# Altium schematic sheet Power.SchDoc
size A4; SheetNumber: 2; SheetTotal: 2
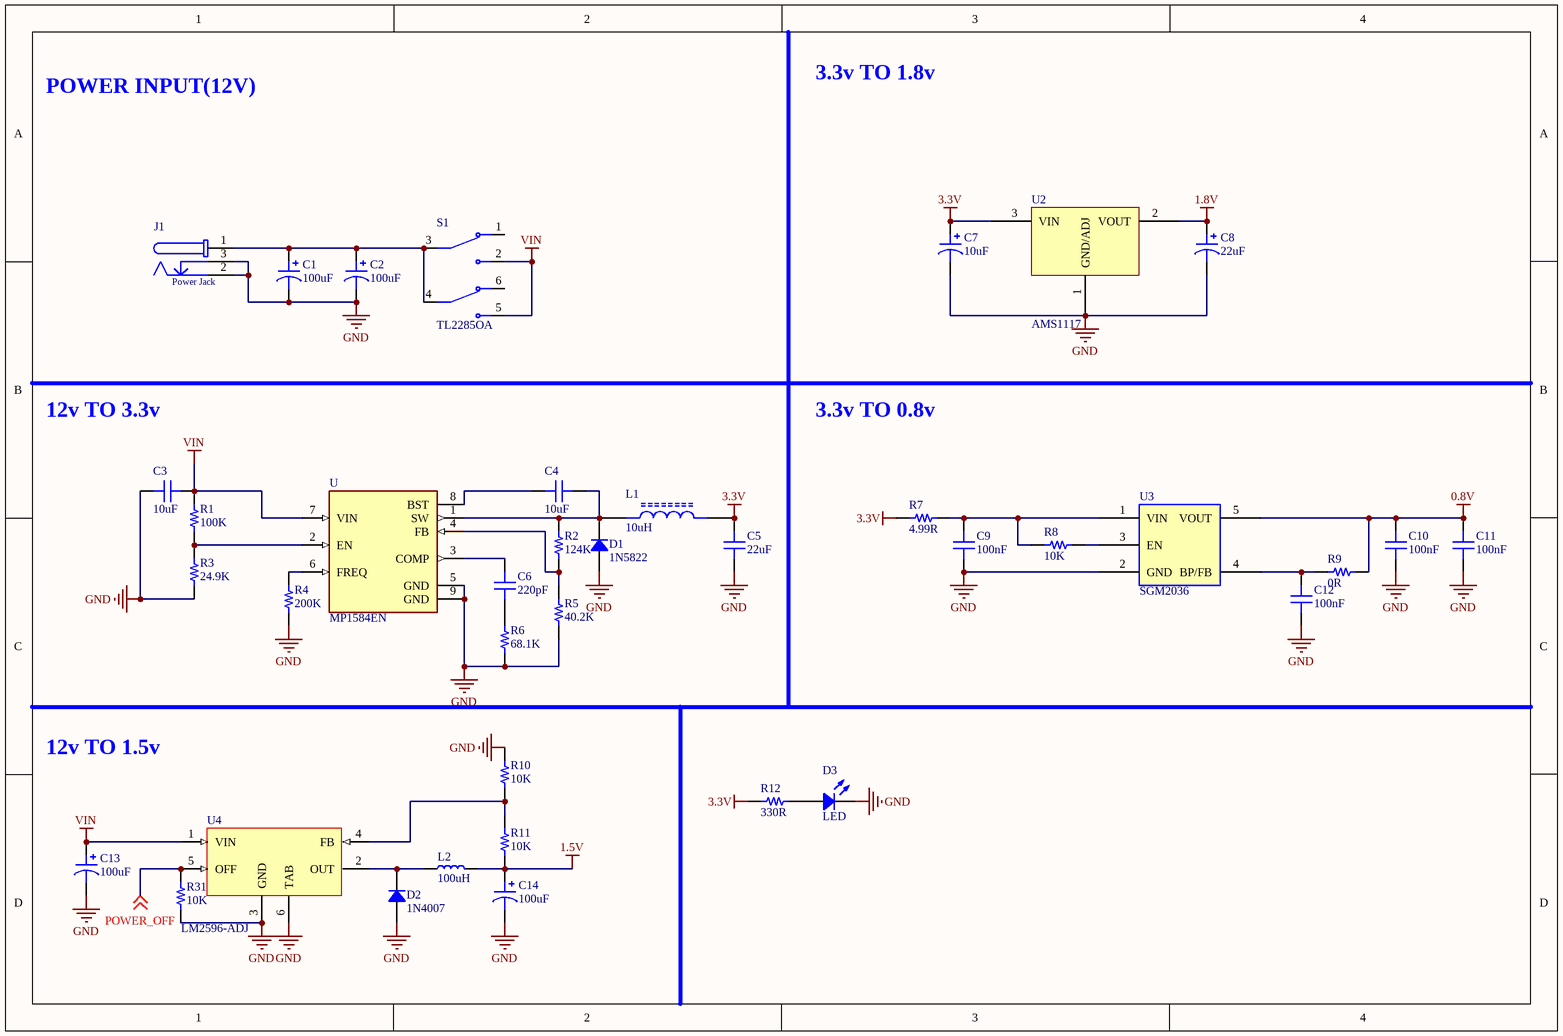
[diagram p0: Power.SchDoc]

## Parts
C1  100uF  [CAP ALUM 10.3MM]
C2  100uF  [CAP ALUM 10.3MM]
C3  10uF  [CAP-SMD-1206]
C4  10uF  [CAP-SMD-1206]
C5  22uF  [CAP-SMD-1206]
C6  220pF  [CAP-SMD-1206]
C7  10uF  [CAP-TAN-CASE-A]
C8  22uF  [CAP-TAN-CASE-A]
C9  100nF  [CAP-SMD-1206]
C10  100nF  [CAP-SMD-1206]
C11  100nF  [CAP-SMD-1206]
C12  100nF  [CAP-SMD-1206]
C13  100uF  [CAP-TAN-CASE-E]
C14  100uF  [CAP-TAN-CASE-E]
D1  1N5822  [m7]
D2  1N4007  [m7]
D3  LED  [LED_0805_RED]
J1  Power Jack  [DC-Jack-THT-RA-6.4]
L1  10uH  [SRN6045TA]
L2  100uH  [inductor]
R1  100K  [RES-SMD-0805]
R2  124K  [RES-SMD-0805]
R3  24.9K  [RES-SMD-0805]
R4  200K  [RES-SMD-0805]
R5  40.2K  [RES-SMD-0805]
R6  68.1K  [RES-SMD-0805]
R7  4.99R  [RES-SMD-0805]
R8  10K  [RES-SMD-0805]
R9  0R  [RES-SMD-0805]
R10  10K  [RES-SMD-0805]
R11  10K  [RES-SMD-0805]
R12  330R  [RES-SMD-0805]
R31  10K  [RES-SMD-0805]
S1  TL2285OA  [SW_TL2285OA]
U  MP1584EN  [SOIC127P600X170-9N]
U2  AMS1117  [AMS1117]
U3  SGM2036  [SOT23-5PIN]
U4  LM2596-ADJ  [LM2576]

## Nets
0.8V: C10.2 C11.2 R9.1 U3.5(VOUT)
1.5V: C14.1 L2.2 R11.2
1.8V: C8.1 U2.2(VOUT)
3.3V: C5.2 C7.1 L1.2 R7.2 R12.2 U2.3(VIN)
GND: C1.2 C2.2 C3.1 C5.1 C7.2 C8.2 C9.1 C10.1 C11.1 C12.1 C13.2 C14.2 D1.1 D2.1 D3.2 J1.2 J1.3 R3.1 R4.1 R5.1 R6.1 R10.1 R31.2 U.5(GND) U.9(GND) U2.1(GND/ADJ) U3.2(GND) U4.3(GND) U4.6(TAB)
VIN: C3.2 C13.1 R1.2 S1.2(NO1) S1.5(NO2) U.7(VIN) U4.1(VIN)
POWER_OFF: R31.1 U4.5(OFF) ; off-sheet POWER_OFF
NetC1_1: C1.1 C2.1 J1.1 S1.3(COM1) S1.4(COM2)
NetC4_1: C4.1 U.8(BST)
NetC4_2: C4.2 D1.2 L1.1 R2.2 U.1(SW)
NetC6_1: C6.1 R6.2
NetC6_2: C6.2 U.3(COMP)
NetC9_2: C9.2 R7.1 R8.2 U3.1(VIN)
NetC12_2: C12.2 R9.2 U3.4(BP/FB)
NetD2_2: D2.2 L2.1 U4.2(OUT)
NetD3_1: D3.1 R12.1
NetR1_1: R1.1 R3.2 U.2(EN)
NetR2_1: R2.1 R5.2 U.4(FB)
NetR4_2: R4.2 U.6(FREQ)
NetR8_1: R8.1 U3.3(EN)
NetR10_2: R10.2 R11.1 U4.4(FB)

Not connected (* = marked no-connect by the designer): S1 1(NC1) 6(NC2)

## Notes on the sheet
- POWER INPUT(12V)
- 3.3v TO 1.8v
- 12v TO 3.3v
- 3.3v TO 0.8v
- 12v TO 1.5v

## Library data of the parts
C1 C2 C7 C8 C13 C14 = POLARIZED CAP
C3-C6 C9-C12 = CAP
D1 = 1N4007
J1 = DC-JACK: DC Power Jack Connector Low Profile with 4 soldering pads; Gender: Male; Plug Inner Diameter: 1.05 mm; Plug Outer Diameter: 3.5 mm; Rated Current: 5 A; Working Voltage: 18 V; Orientation: Right Angled; Operating Temperature: -40 to 85 degC; Mounting Technology: SMT
L1 = SRN6045TA-3R3Y: 3.3µH Semi-Shielded Wirewound Inductor 5A 21mOhm Nonstandard
L2 = inductor
R1-R12 R31 = RES
S1 = TL2285OA: Pushbutton Switch DPDT Standard Through Hole; MF: E-Switch; Package: None; Availability: In Stock; Check_prices: https://www.snapeda.com/parts/TL2285OA/E-Switch/view-part/?ref=eda; Purchase-URL: https://pricing.snapeda.com/search/part/TL2285OA/?ref=eda; Value: *; MP: TL2285OA; SnapEDA_Link: https://www.snapeda.com/parts/TL2285OA/E-Switch/view-part/?ref=snap; Price: None
U = MP1584EN: Buck Switching Regulator IC Positive Adjustable 0.8V 1 Output 3A 8-SOIC _0.154, 3.90mm Width_ Exposed Pad; MF: Monolithic Power; MP: MP1584EN; Value: *; Package: SOIC-8 Monolithic Power; SnapEDA_Link: https://www.snapeda.com/parts/MP1584EN/Monolithic%20Power%20Systems%20Inc./view-part/891721/?ref=snap; Price: None; Availability: Unavailable
U2 = AMS1117: AMS1117 1A LOW DROPOUT VOLTAGE REGULATOR
U4 = LM2576S-5.0: SIMPLE SWITCHER® 40V, 3A Low Component Count Step-Down Regulator 5-DDPAK/TO-263 -40 to 125; Manufacturer: TI National Semiconductor; Manufacturer Part Number: LM2576S-5.0/NOPB; Min Supply Voltage: 4V; Number of Outputs: 1; Output Voltage: 5V; Frequency: 52kHz; Switching Frequency: 58kHz; Efficiency: 77%; Quiescent Current: 5mA; Output Type: Fixed; Supplier 1: Digi-Key; RoHS: Yes; Category: Voltage Regulators - Switching; Stock 1: 747; Pricing 1: 1=4.79000, 10=4.30600, 25=4.07120, 100=3.52840, 250=3.34744, 500=3.00364, 1000=2.98725 (USD); Mount: Surface Mount; Case/Package: TO-263; Number of Pins: 5; Weight: 0.25lb; Contact Plating: Tin,Matte; Min Operating Temperature: -40°C; Max Operating Temperature: 125°C; Max Supply Voltage: 40V; Max Output Current: 3A; Packaging: Rail/Tube; Min Input Voltage: 4V; Max Input Voltage: 40V; Output Current: 3A; Package Quantity: 45; Nominal Output Voltage: 5V; Max Output Voltage: 5V; Termination: SMD/SMT; Series: LM2576; Length: 10.16mm; Width: 8.64mm; Height: 4.57mm; Radiation Hardening: No; REACH SVHC: No SVHC; Lead Free: Contains Lead; RoHS Compliant: Yes; ComponentLink1URL: https://datasheet.ciiva.com/27050/894690-27050690.pdf?src-supplier=Jameco; ComponentLink1Description: https://datasheet.ciiva.com/27050/894690-27050690.pdf?src-supplier=Jameco; ComponentLink2URL: https://datasheet.ciiva.com/15112/getdatasheetpartid-89880-15112831.pdf?src-supplier=Verical; ComponentLink2Description: https://datasheet.ciiva.com/15112/getdatasheetpartid-89880-15112831.pdf?src-supplier=Verical; ComponentLink3URL: https://datasheet.ciiva.com/6596/lm2576hv-6596629.pdf?src-supplier=Digi-Key; ComponentLink3Description: https://datasheet.ciiva.com/6596/lm2576hv-6596629.pdf?src-supplier=Digi-Key; ComponentLink4URL: https://datasheet.ciiva.com/16466/lm2576-16466309.pdf?src-supplier=Avnet+Asia; ComponentLink4Description: https://datasheet.ciiva.com/16466/lm2576-16466309.pdf?src-supplier=Avnet+Asia; ComponentLink5URL: https://datasheet.ciiva.com/7994/1849802-7994190.pdf?src-supplier=Element14; ComponentLink5Description: https://datasheet.ciiva.com/7994/1849802-7994190.pdf?src-supplier=Element14; Supplier Part Number 1: LM2576S-5.0/NOPB-ND